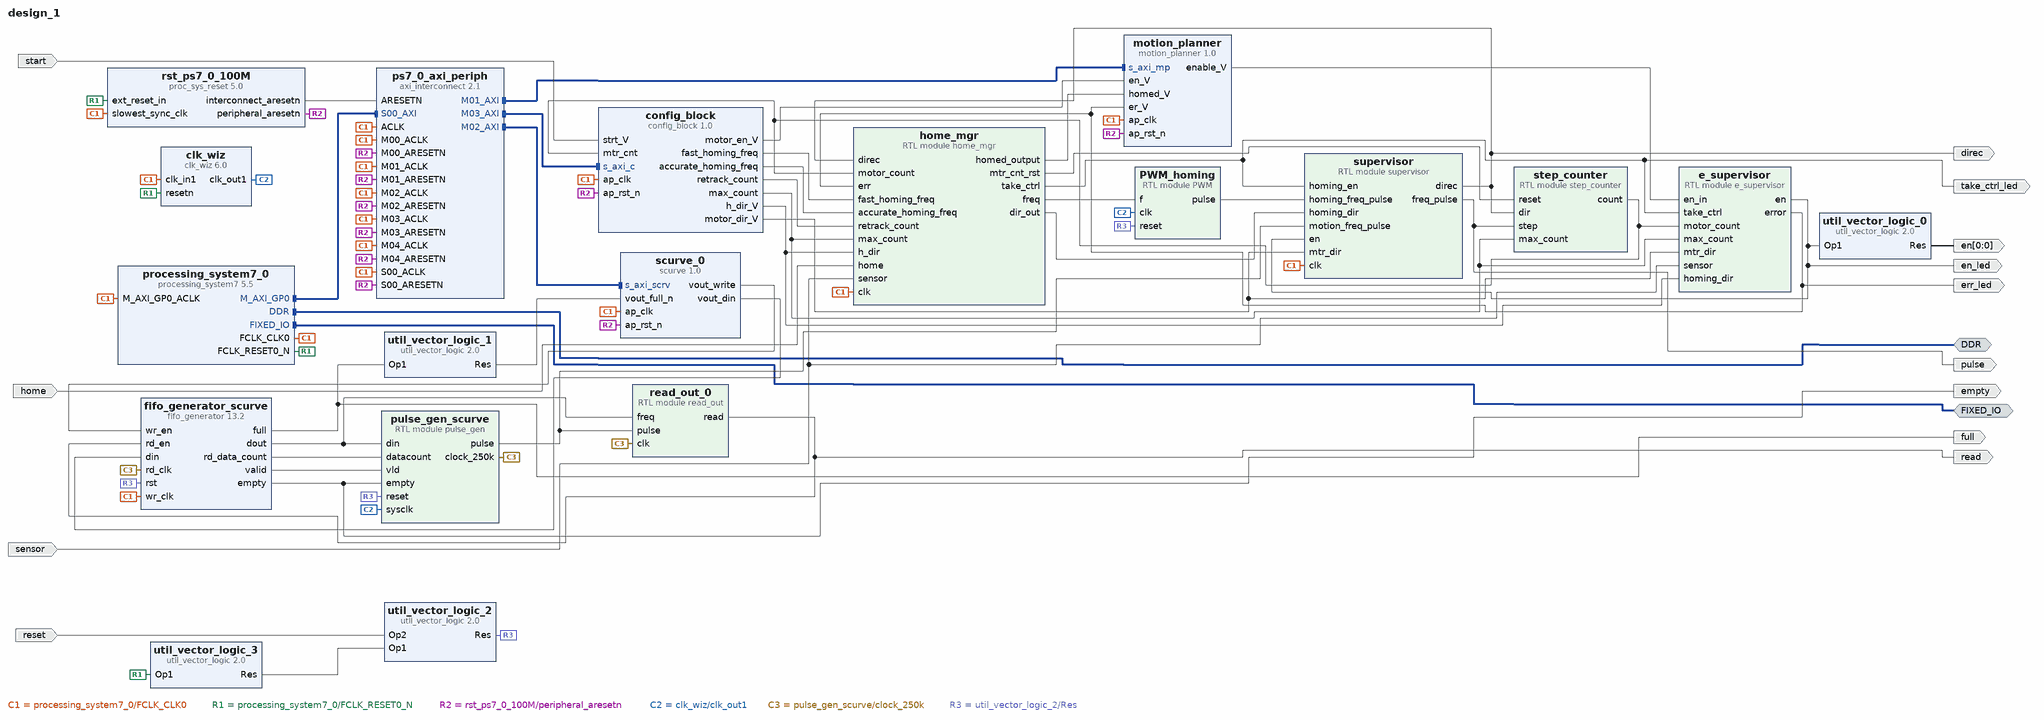
[diagram p0: block diagram of the top level]
# Vivado block design design_1, xc7z020clg400-1, Vivado 2018.2
create_bd_design design_1

create_bd_intf_port -mode Master -vlnv xilinx.com:interface:ddrx_rtl:1.0 DDR
create_bd_intf_port -mode Master -vlnv xilinx.com:display_processing_system7:fixedio_rtl:1.0 FIXED_IO
create_bd_port -dir O direc
create_bd_port -dir O take_ctrl_led
create_bd_port -dir I -type rst reset
set_property -dict {CONFIG.POLARITY ACTIVE_LOW} [get_bd_ports reset]
create_bd_port -dir I -type data sensor
set_property -dict [list \
  CONFIG.LAYERED_METADATA {xilinx.com:interface:datatypes:1.0 {DATA {datatype {name {attribs {resolve_type immediate dependency {} format string minimum {} maximum {}} value {}} bitwidth {attribs {resolve_type immediate dependency {} format long minimum {} maximum {}} value 1} bitoffset {attribs {resolve_type immediate dependency {} format long minimum {} maximum {}} value 0}}}}} \
] [get_bd_ports sensor]
create_bd_port -dir O err_led
create_bd_port -dir I home
create_bd_port -dir O en_led
create_bd_port -dir O read
create_bd_port -dir O pulse
create_bd_port -dir O full
create_bd_port -dir O empty
create_bd_port -dir O -from 0 -to 0 en
create_bd_port -dir I start

create_bd_cell -type ip -vlnv xilinx.com:ip:processing_system7:5.5 processing_system7_0
set_property -dict [list \
  CONFIG.PCW_UIPARAM_DDR_FREQ_MHZ 525 \
  CONFIG.PCW_CRYSTAL_PERIPHERAL_FREQMHZ 50 \
  CONFIG.PCW_APU_PERIPHERAL_FREQMHZ 650 \
  CONFIG.PCW_SDIO_PERIPHERAL_FREQMHZ 50 \
  CONFIG.PCW_UART_PERIPHERAL_FREQMHZ 100 \
  CONFIG.PCW_FPGA0_PERIPHERAL_FREQMHZ 100 \
  CONFIG.PCW_FPGA1_PERIPHERAL_FREQMHZ 50 \
  CONFIG.PCW_M_AXI_GP0_FREQMHZ 10 \
  CONFIG.PCW_PERIPHERAL_BOARD_PRESET None \
  CONFIG.PCW_PRESET_BANK1_VOLTAGE {LVCMOS 1.8V} \
  CONFIG.PCW_UIPARAM_DDR_BUS_WIDTH {16 Bit} \
  CONFIG.PCW_UIPARAM_DDR_PARTNO {MT41J256M16 RE-125} \
  CONFIG.PCW_QSPI_PERIPHERAL_ENABLE 1 \
  CONFIG.PCW_QSPI_QSPI_IO {MIO 1 .. 6} \
  CONFIG.PCW_QSPI_GRP_SINGLE_SS_ENABLE 1 \
  CONFIG.PCW_QSPI_GRP_SINGLE_SS_IO {MIO 1 .. 6} \
  CONFIG.PCW_SINGLE_QSPI_DATA_MODE x4 \
  CONFIG.PCW_QSPI_GRP_FBCLK_ENABLE 1 \
  CONFIG.PCW_QSPI_GRP_FBCLK_IO {MIO 8} \
  CONFIG.PCW_ENET0_PERIPHERAL_ENABLE 1 \
  CONFIG.PCW_ENET0_ENET0_IO {MIO 16 .. 27} \
  CONFIG.PCW_ENET0_GRP_MDIO_ENABLE 1 \
  CONFIG.PCW_ENET0_GRP_MDIO_IO {MIO 52 .. 53} \
  CONFIG.PCW_ENET_RESET_ENABLE 1 \
  CONFIG.PCW_ENET_RESET_SELECT {Share reset pin} \
  CONFIG.PCW_ENET0_RESET_ENABLE 1 \
  CONFIG.PCW_ENET0_RESET_IO {MIO 9} \
  CONFIG.PCW_SD0_PERIPHERAL_ENABLE 1 \
  CONFIG.PCW_SD0_SD0_IO {MIO 40 .. 45} \
  CONFIG.PCW_SD0_GRP_CD_ENABLE 1 \
  CONFIG.PCW_SD0_GRP_CD_IO {MIO 47} \
  CONFIG.PCW_SD0_GRP_WP_ENABLE 0 \
  CONFIG.PCW_UART0_PERIPHERAL_ENABLE 1 \
  CONFIG.PCW_UART0_UART0_IO {MIO 14 .. 15} \
  CONFIG.PCW_UART1_PERIPHERAL_ENABLE 0 \
  CONFIG.PCW_USB0_PERIPHERAL_ENABLE 1 \
  CONFIG.PCW_USB0_USB0_IO {MIO 28 .. 39} \
  CONFIG.PCW_USB_RESET_ENABLE 1 \
  CONFIG.PCW_USB_RESET_SELECT {Share reset pin} \
  CONFIG.PCW_USB0_RESET_ENABLE 1 \
  CONFIG.PCW_USB0_RESET_IO {MIO 46} \
  CONFIG.PCW_I2C_RESET_ENABLE 1 \
  CONFIG.PCW_GPIO_MIO_GPIO_ENABLE 1 \
  CONFIG.PCW_GPIO_MIO_GPIO_IO MIO \
] [get_bd_cells processing_system7_0]
# 481 more settings of processing_system7_0 are not shown: defaults, MIO pin electricals, DDR timing, and values the tool derives
create_bd_cell -type ip -vlnv xilinx.com:ip:axi_interconnect:2.1 ps7_0_axi_periph
set_property -dict {CONFIG.NUM_MI 5} [get_bd_cells ps7_0_axi_periph]
create_bd_cell -type ip -vlnv xilinx.com:ip:proc_sys_reset:5.0 rst_ps7_0_100M
create_bd_cell -type ip -vlnv xilinx.com:ip:clk_wiz:6.0 clk_wiz
set_property -dict [list \
  CONFIG.PRIMITIVE PLL \
  CONFIG.JITTER_SEL Min_O_Jitter \
  CONFIG.CLKOUT1_REQUESTED_OUT_FREQ 6.25 \
  CONFIG.CLKOUT1_DRIVES BUFG \
  CONFIG.CLKOUT2_DRIVES BUFG \
  CONFIG.CLKOUT3_DRIVES BUFG \
  CONFIG.CLKOUT4_DRIVES BUFG \
  CONFIG.CLKOUT5_DRIVES BUFG \
  CONFIG.CLKOUT6_DRIVES BUFG \
  CONFIG.CLKOUT7_DRIVES BUFG \
  CONFIG.RESET_PORT resetn \
  CONFIG.OVERRIDE_MMCM true \
  CONFIG.MMCM_DIVCLK_DIVIDE 1 \
  CONFIG.MMCM_BANDWIDTH HIGH \
  CONFIG.MMCM_CLKFBOUT_MULT_F 8 \
  CONFIG.MMCM_CLKIN1_PERIOD 10.0 \
  CONFIG.MMCM_CLKIN2_PERIOD 10.0 \
  CONFIG.MMCM_COMPENSATION BUF_IN \
  CONFIG.MMCM_CLKOUT0_DIVIDE_F 128 \
  CONFIG.RESET_TYPE ACTIVE_LOW \
  CONFIG.CLKOUT1_JITTER 251.196 \
  CONFIG.CLKOUT1_PHASE_ERROR 114.212 \
] [get_bd_cells clk_wiz]
create_bd_cell -type module -reference step_counter step_counter
create_bd_cell -type ip -vlnv xilinx.com:ip:util_vector_logic:2.0 util_vector_logic_0
set_property -dict {CONFIG.C_SIZE 1 CONFIG.C_OPERATION not} [get_bd_cells util_vector_logic_0]
create_bd_cell -type ip -vlnv xilinx.com:ip:fifo_generator:13.2 fifo_generator_scurve
set_property -dict [list \
  CONFIG.Fifo_Implementation Independent_Clocks_Distributed_RAM \
  CONFIG.Performance_Options Standard_FIFO \
  CONFIG.Input_Data_Width 32 \
  CONFIG.Input_Depth 4096 \
  CONFIG.Reset_Pin true \
  CONFIG.Enable_Reset_Synchronization true \
  CONFIG.Full_Flags_Reset_Value 0 \
  CONFIG.Use_Dout_Reset true \
  CONFIG.Valid_Flag true \
  CONFIG.Underflow_Flag false \
  CONFIG.Write_Acknowledge_Flag false \
  CONFIG.Read_Data_Count true \
  CONFIG.Read_Data_Count_Width 12 \
  CONFIG.Programmable_Empty_Type No_Programmable_Empty_Threshold \
] [get_bd_cells fifo_generator_scurve]
create_bd_cell -type module -reference PWM PWM_homing
create_bd_cell -type module -reference supervisor supervisor
create_bd_cell -type ip -vlnv xilinx.com:ip:util_vector_logic:2.0 util_vector_logic_1
set_property -dict {CONFIG.C_SIZE 1 CONFIG.C_OPERATION not} [get_bd_cells util_vector_logic_1]
create_bd_cell -type ip -vlnv xilinx.com:hls:motion_planner:1.0 motion_planner
create_bd_cell -type module -reference home_mgr home_mgr
create_bd_cell -type module -reference read_out read_out_0
create_bd_cell -type module -reference pulse_gen pulse_gen_scurve
create_bd_cell -type ip -vlnv xilinx.com:ip:util_vector_logic:2.0 util_vector_logic_2
set_property -dict {CONFIG.C_SIZE 1 CONFIG.C_OPERATION or} [get_bd_cells util_vector_logic_2]
create_bd_cell -type ip -vlnv xilinx.com:ip:util_vector_logic:2.0 util_vector_logic_3
set_property -dict {CONFIG.C_SIZE 1 CONFIG.C_OPERATION not} [get_bd_cells util_vector_logic_3]
create_bd_cell -type module -reference e_supervisor e_supervisor
create_bd_cell -type ip -vlnv xilinx.com:hls:config_block:1.0 config_block
create_bd_cell -type ip -vlnv xilinx.com:hls:scurve:1.0 scurve_0

# ---- connections ----

connect_bd_intf_net [get_bd_intf_pins processing_system7_0/M_AXI_GP0] [get_bd_intf_pins ps7_0_axi_periph/S00_AXI]
connect_bd_intf_net [get_bd_intf_pins ps7_0_axi_periph/M01_AXI] [get_bd_intf_pins motion_planner/s_axi_mp]
connect_bd_intf_net [get_bd_intf_pins ps7_0_axi_periph/M03_AXI] [get_bd_intf_pins config_block/s_axi_c]
connect_bd_intf_net [get_bd_intf_pins ps7_0_axi_periph/M02_AXI] [get_bd_intf_pins scurve_0/s_axi_scrv]
connect_bd_intf_net [get_bd_intf_ports DDR] [get_bd_intf_pins processing_system7_0/DDR]
connect_bd_intf_net [get_bd_intf_ports FIXED_IO] [get_bd_intf_pins processing_system7_0/FIXED_IO]
connect_bd_net [get_bd_pins processing_system7_0/FCLK_CLK0] \
  [get_bd_pins processing_system7_0/M_AXI_GP0_ACLK] [get_bd_pins rst_ps7_0_100M/slowest_sync_clk] \
  [get_bd_pins clk_wiz/clk_in1] [get_bd_pins supervisor/clk] [get_bd_pins fifo_generator_scurve/wr_clk] \
  [get_bd_pins motion_planner/ap_clk] [get_bd_pins home_mgr/clk] [get_bd_pins ps7_0_axi_periph/S00_ACLK] \
  [get_bd_pins ps7_0_axi_periph/ACLK] [get_bd_pins ps7_0_axi_periph/M01_ACLK] [get_bd_pins ps7_0_axi_periph/M02_ACLK] \
  [get_bd_pins ps7_0_axi_periph/M03_ACLK] [get_bd_pins ps7_0_axi_periph/M04_ACLK] [get_bd_pins ps7_0_axi_periph/M00_ACLK] \
  [get_bd_pins config_block/ap_clk] [get_bd_pins scurve_0/ap_clk]
connect_bd_net [get_bd_pins processing_system7_0/FCLK_RESET0_N] \
  [get_bd_pins rst_ps7_0_100M/ext_reset_in] [get_bd_pins clk_wiz/resetn] [get_bd_pins util_vector_logic_3/Op1]
connect_bd_net [get_bd_pins rst_ps7_0_100M/peripheral_aresetn] \
  [get_bd_pins motion_planner/ap_rst_n] [get_bd_pins ps7_0_axi_periph/S00_ARESETN] [get_bd_pins ps7_0_axi_periph/M00_ARESETN] \
  [get_bd_pins ps7_0_axi_periph/M01_ARESETN] [get_bd_pins ps7_0_axi_periph/M02_ARESETN] \
  [get_bd_pins ps7_0_axi_periph/M03_ARESETN] [get_bd_pins ps7_0_axi_periph/M04_ARESETN] [get_bd_pins config_block/ap_rst_n] \
  [get_bd_pins scurve_0/ap_rst_n]
connect_bd_net [get_bd_pins rst_ps7_0_100M/interconnect_aresetn] [get_bd_pins ps7_0_axi_periph/ARESETN]
connect_bd_net -net clk_wiz_0_clk_out1 [get_bd_pins clk_wiz/clk_out1] [get_bd_pins PWM_homing/clk] [get_bd_pins pulse_gen_scurve/sysclk]
connect_bd_net -net pulse_gen_0_pulse [get_bd_pins pulse_gen_scurve/pulse] [get_bd_pins supervisor/motion_freq_pulse] [get_bd_pins read_out_0/pulse]
connect_bd_net -net PWM_0_pulse [get_bd_pins PWM_homing/pulse] [get_bd_pins supervisor/homing_freq_pulse]
connect_bd_net [get_bd_pins step_counter/count] \
  [get_bd_pins home_mgr/motor_count] [get_bd_pins e_supervisor/motor_count] [get_bd_pins config_block/mtr_cnt]
connect_bd_net -net supervisor_direc_fwd [get_bd_pins supervisor/direc] \
  [get_bd_ports direc] [get_bd_pins step_counter/dir] [get_bd_pins home_mgr/direc]
connect_bd_net -net motion_management_enable [get_bd_pins home_mgr/take_ctrl] \
  [get_bd_ports take_ctrl_led] [get_bd_pins supervisor/homing_en] [get_bd_pins e_supervisor/take_ctrl]
connect_bd_net -net motion_management_forward [get_bd_pins home_mgr/dir_out] [get_bd_pins supervisor/homing_dir]
connect_bd_net [get_bd_ports reset] [get_bd_pins util_vector_logic_2/Op2]
connect_bd_net [get_bd_ports sensor] [get_bd_pins home_mgr/sensor] [get_bd_pins e_supervisor/sensor]
connect_bd_net [get_bd_pins e_supervisor/error] [get_bd_ports err_led] [get_bd_pins motion_planner/er_V] [get_bd_pins home_mgr/err]
connect_bd_net -net home_V_0_1 [get_bd_ports home] [get_bd_pins home_mgr/home]
connect_bd_net [get_bd_pins e_supervisor/en] [get_bd_ports en_led] [get_bd_pins util_vector_logic_0/Op1] [get_bd_pins supervisor/en]
connect_bd_net -net home_mgr_0_freq [get_bd_pins home_mgr/freq] [get_bd_pins PWM_homing/f]
connect_bd_net -net home_mgr_0_homed_output [get_bd_pins home_mgr/homed_output] [get_bd_pins motion_planner/homed_V]
connect_bd_net -net home_mgr_0_mtr_cnt_rst [get_bd_pins home_mgr/mtr_cnt_rst] [get_bd_pins step_counter/reset]
connect_bd_net [get_bd_pins config_block/motor_en_V] [get_bd_pins motion_planner/en_V]
connect_bd_net [get_bd_pins config_block/motor_dir_V] [get_bd_pins supervisor/mtr_dir] [get_bd_pins e_supervisor/mtr_dir]
connect_bd_net [get_bd_pins config_block/max_count] \
  [get_bd_pins step_counter/max_count] [get_bd_pins home_mgr/max_count] [get_bd_pins e_supervisor/max_count]
connect_bd_net [get_bd_pins motion_planner/enable_V] [get_bd_pins e_supervisor/en_in]
connect_bd_net [get_bd_pins config_block/h_dir_V] [get_bd_pins home_mgr/h_dir] [get_bd_pins e_supervisor/homing_dir]
connect_bd_net -net pulse_gen_0_read [get_bd_pins read_out_0/read] [get_bd_ports read] [get_bd_pins fifo_generator_scurve/rd_en]
connect_bd_net [get_bd_pins supervisor/freq_pulse] [get_bd_ports pulse] [get_bd_pins step_counter/step]
connect_bd_net [get_bd_pins fifo_generator_scurve/full] [get_bd_ports full] [get_bd_pins util_vector_logic_1/Op1]
connect_bd_net [get_bd_pins pulse_gen_scurve/clock_250k] [get_bd_pins fifo_generator_scurve/rd_clk] [get_bd_pins read_out_0/clk]
connect_bd_net [get_bd_pins config_block/fast_homing_freq] [get_bd_pins home_mgr/fast_homing_freq]
connect_bd_net [get_bd_pins config_block/accurate_homing_freq] [get_bd_pins home_mgr/accurate_homing_freq]
connect_bd_net [get_bd_pins config_block/retrack_count] [get_bd_pins home_mgr/retrack_count]
connect_bd_net -net s_curve_mahan_freq_write [get_bd_pins scurve_0/vout_write] [get_bd_pins fifo_generator_scurve/wr_en]
connect_bd_net [get_bd_pins fifo_generator_scurve/rd_data_count] [get_bd_pins pulse_gen_scurve/datacount]
connect_bd_net [get_bd_pins fifo_generator_scurve/dout] [get_bd_pins read_out_0/freq] [get_bd_pins pulse_gen_scurve/din]
connect_bd_net [get_bd_pins fifo_generator_scurve/valid] [get_bd_pins pulse_gen_scurve/vld]
connect_bd_net [get_bd_pins fifo_generator_scurve/empty] [get_bd_ports empty] [get_bd_pins pulse_gen_scurve/empty]
connect_bd_net [get_bd_pins scurve_0/vout_din] [get_bd_pins fifo_generator_scurve/din]
# net config_block_v has one end: 
# net config_block_ve has one end: 
# net config_block_vs has one end: 
# net config_block_J has one end: 
# net config_block_L has one end: 
connect_bd_net [get_bd_pins util_vector_logic_1/Res] [get_bd_pins scurve_0/vout_full_n]
connect_bd_net [get_bd_pins util_vector_logic_2/Res] \
  [get_bd_pins fifo_generator_scurve/rst] [get_bd_pins PWM_homing/reset] [get_bd_pins pulse_gen_scurve/reset]
connect_bd_net [get_bd_pins util_vector_logic_3/Res] [get_bd_pins util_vector_logic_2/Op1]
connect_bd_net [get_bd_pins util_vector_logic_0/Res] [get_bd_ports en]
connect_bd_net [get_bd_ports start] [get_bd_pins config_block/strt_V]

# ---- address map ----
assign_bd_address -offset 0x43C10000 -range 64K -target_address_space [get_bd_addr_spaces processing_system7_0/Data] [get_bd_addr_segs motion_planner/s_axi_mp/Reg]
assign_bd_address -offset 0x43C20000 -range 64K -target_address_space [get_bd_addr_spaces processing_system7_0/Data] [get_bd_addr_segs config_block/s_axi_c/Reg]
assign_bd_address -offset 0x43C30000 -range 64K -target_address_space [get_bd_addr_spaces processing_system7_0/Data] [get_bd_addr_segs scurve_0/s_axi_scrv/Reg]

validate_bd_design
save_bd_design
